# EAGLE design power supply (EAGLE 6.0)
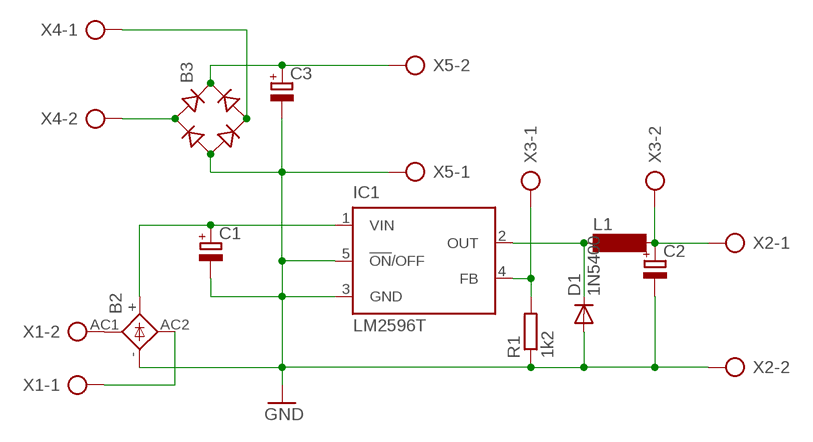
[diagram p0: schematic, sheet 1]

## Parts
B2  FB15  [FB15]
B3  B-DIL  [B-DIL]
C1  CPOL-EUTT5D11  [TT5D11]
C2  CPOL-EUTT5D11  [TT5D11]
C3  CPOL-EUTT5D11  [TT5D11]
D1  1N5400  [DO201-15]
IC1  LM2596T  [T05D]
L1  SD12K-82  [SD12K-82]
R1  1k2  R-EU_0207/10  [0207/10]
X1  AK300/2  [AK300/2]
X2  AK300/2  [AK300/2]
X3  AK300/2  [AK300/2]
X4  AK300/2  [AK300/2]
X5  AK300/2  [AK300/2]

## Nets
+12V: B2.+ C1.+ IC1.1(VIN)
GND: B2.- B3.- C1.- C2.- C3.- D1.A IC1.3(GND) IC1.5(!ON!/OFF) R1.1 X2.2 X5.1
N$1: IC1.4(FB) R1.2 X3.1
N$2: B2.AC2 X1.1
N$3: C2.+ L1.2 X2.1 X3.2
N$4: B2.AC1 X1.2
N$5: B3.AC1 X4.2
N$6: D1.C IC1.2(OUT) L1.1
N$7: B3.AC2 X4.1
N$9: B3.+ C3.+ X5.2

## Library data of the parts
B2 = rectifier:FB15: FAGOR RECTIFIER grid 3 x 5 mm
B3 = rectifier:B-DIL: RECTIFIER
C1-C3 = rcl:CPOL-EU: POLARIZED CAPACITOR, European symbol
D1 = diode:1N5400: DIODE standard rectifier, 3 A, 50 V (Motorola)
IC1 = national-semiconductor:LM2596: SIMPLE SWITCHER® Power Converter 150 kHz 3A Step-Down Voltage Regulator Source: http://www.national.com/ds/LM/LM2596.pdf; MPN: LM2596T-ADJ/LF02; OC_FARNELL: 9494162; OC_NEWARK: 65K5910
L1 = inductor-neosid:SD12: INDUCTOR nominal inductance; OC_FARNELL: unknown; OC_NEWARK: unknown
R1 = rcl:R-EU_: RESISTOR, European symbol
X1-X5 = con-ptr500:AK300/2: CONNECTOR; OC_FARNELL: unknown; OC_NEWARK: unknown

## Board
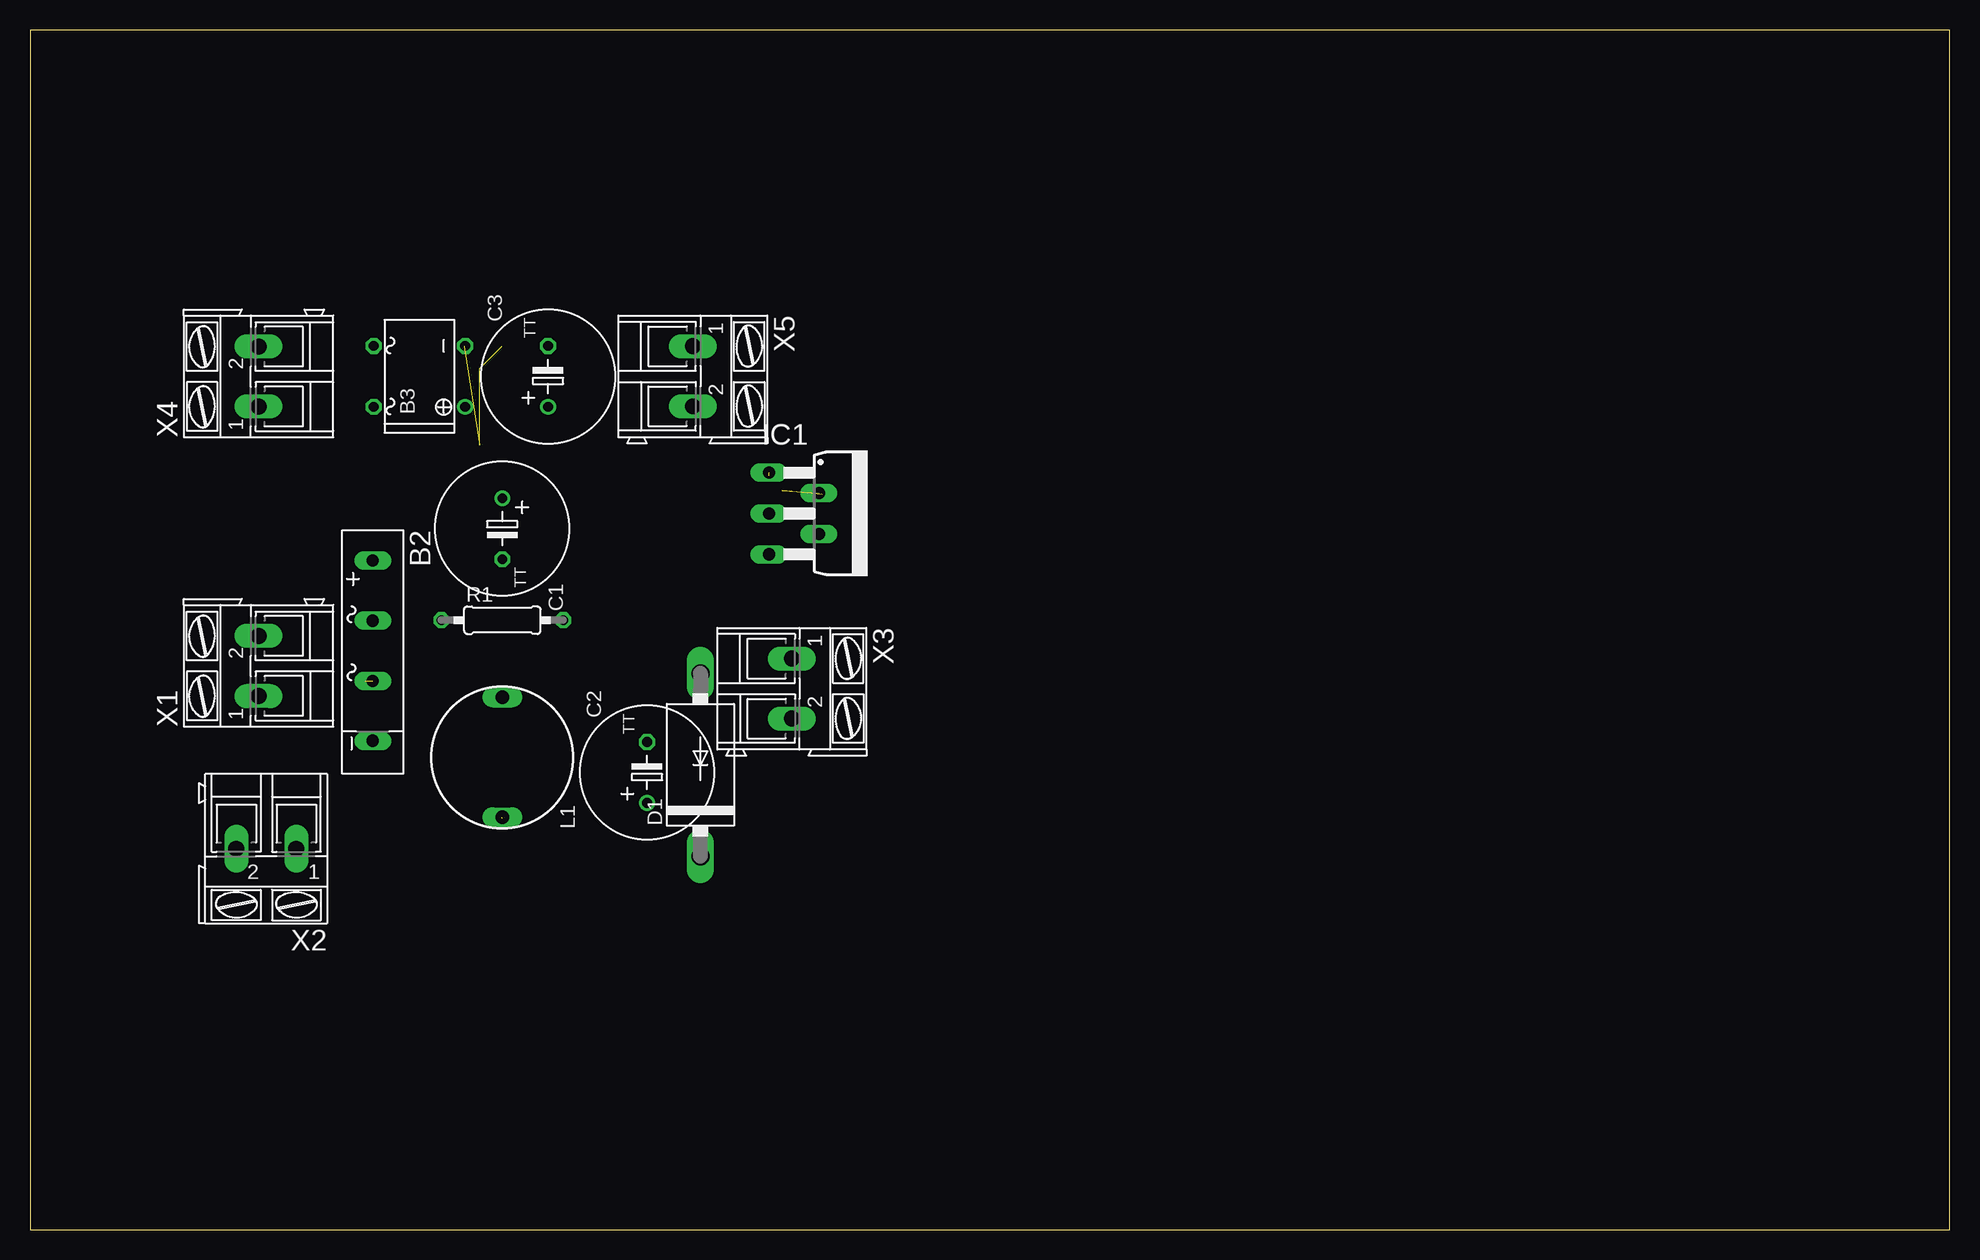
[diagram p1: board, top side]
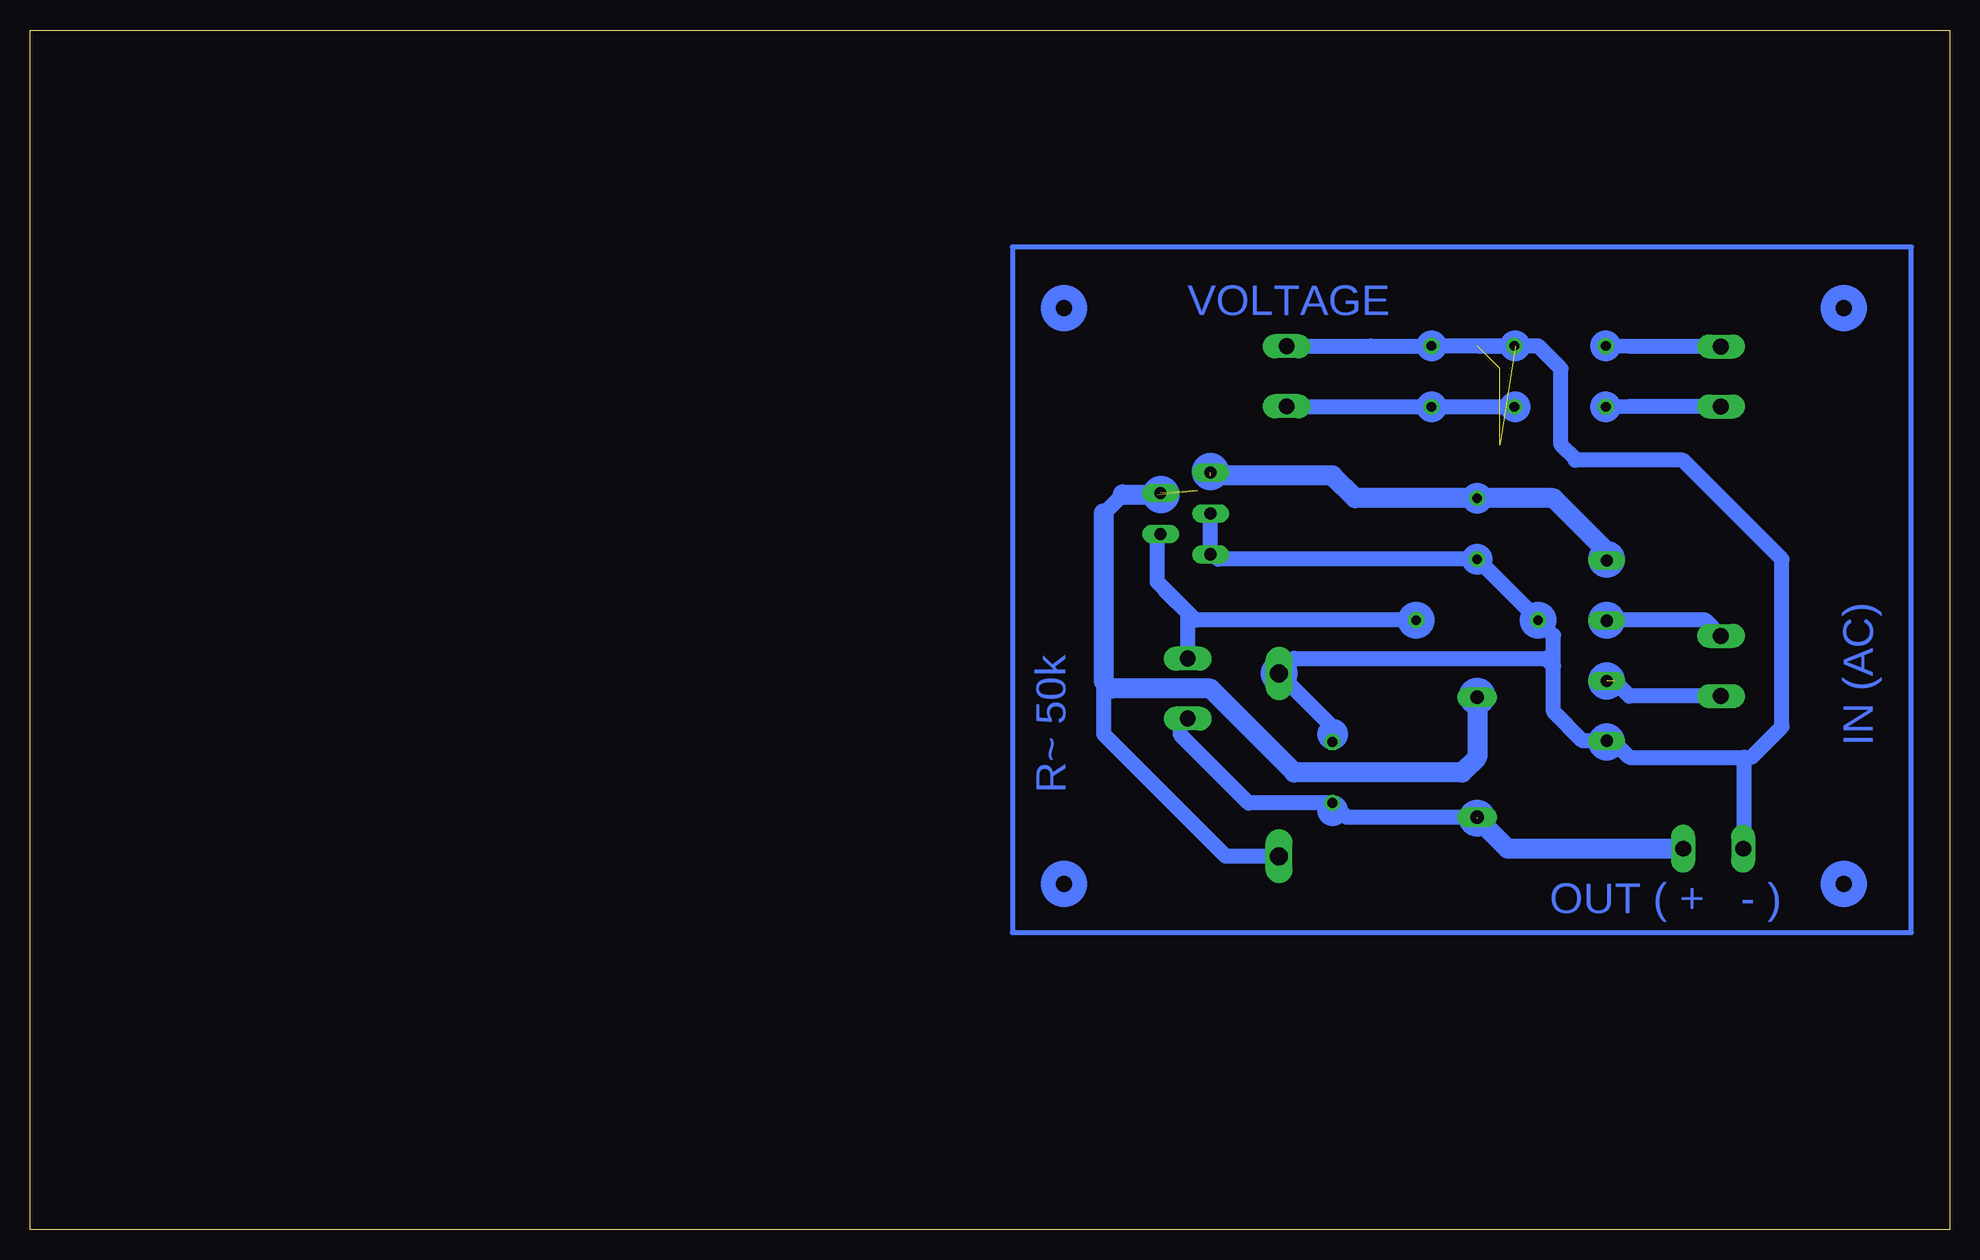
[diagram p2: board, bottom side, seen from below]

Size 160 x 100 mm. Coordinates in mm from the lower left corner, seen from the top.
Outline: 0,0 160,0 160,100 0,100 0,0
Copper layers (1*16): Top 0.035mm / dielectric 1.5mm / Bottom 0.035mm
Design rules: minimum track width 10mil, minimum drill 24mil, track to track 8mil, track to pad 8mil, pad to pad 8mil, via to via 8mil, smd to smd 8mil, copper to edge 40mil, drill to drill 8mil, minimum pad ring 10mil, minimum via ring 8mil, stop-mask expansion 4mil, vias tented up to drill 0mil, thermal gap 10mil

### Footprints (pad centres in the part's own frame; a part is rotated, then mirrored left to right if it is on the bottom)
FB15 = drill 1.016 long: + -7.5,0; - 7.511,0; AC1 -2.496,0; AC2 2.533,0
B-DIL = drill 0.813: + -2.54,-3.81 | drill 0.813 octagon: - 2.54,-3.81; AC1 2.54,3.81; AC2 -2.54,3.81
TT5D11 = drill 0.813: + -2.54,0 | drill 0.813 octagon: - 2.54,0
DO201-15 = drill 1.499 long: A 7.62,0; C -7.62,0
T05D = drill 1.016 long: 1 -3.404,-5.08; 2 -1.702,-0.914; 3 0,-5.08; 4 1.702,-0.914; 5 3.404,-5.08
SD12K-82 = drill 1.1 long: 1 -5,0; 2 5,0
0207/10 = drill 0.813 octagon: 1 -5.08,0; 2 5.08,0
AK300/2 = drill 1.321 long: 1 -2.515,0; 2 2.489,0

### Placement (x,y rotation side)
B2  28.57,48.26 270 top
B3  32.47,71.12 90 top
C1  39.37,58.42 270 top
C2  51.44,38.1 90 top
C3  43.18,71.12 90 top
D1  55.88,38.73 90 top
IC1  66.67,59.69 270 top
L1  39.37,39.37 270 top
R1  39.37,50.8 0 top
X1  19.05,46.99 90 top
X2  19.68,31.75 180 top
X3  63.5,45.09 270 top
X4  19.05,71.12 90 top
X5  55.24,71.12 270 top

### Tracks (layer width: path | path; a pad name or v marks a point on that pad's centre or on a via)
+12V  (1 unrouted)
  Bottom 1.27: B2.+ 28.57,56.52
  Bottom 1.676: 28.57,56.52 33.02,60.96 C1.+ 49.53,60.96 51.44,62.87 61.59,62.87
GND  (3 unrouted)
  Bottom 0.406: C1.- 39.6,55.65 60.96,55.65 IC1.5 61.59,56.52
  Bottom 1.27: IC1.3 61.59,56.52 60.96,55.88 C1.- R1.1 33.02,49.53 33.02,46.99 | 33.02,46.99 33.02,43.18 30.59,40.75 B2.- 28.05,40.75 26.67,39.37 17.14,39.37 | C2.- 51.44,41.91 D1.A 54.61,47.62 33.66,47.62 33.02,46.99 | X5.1 50.77,73.64 48.26,73.66 C3.- B3.- 39.37,73.66 | 17.14,39.37 17.14,31.8 X2.2 | 17.14,39.37 16.51,39.37 13.97,41.91 13.97,55.88 22.23,64.14 31.2,64.14 31.2,64.22 32.38,65.41 32.38,71.75 34.29,73.66 36.2,73.66
N$1
  Bottom 0.406: R1.2 63.5,50.8 | IC1.4 65.76,53.06 63.5,50.8 | X3.1 63.5,47.62 63.5,50.8
  Bottom 1.27: R1.2 62.87,50.8 63.5,51.44 | 63.5,51.44 66.04,53.98 66.04,57.78 | 63.5,47.62 63.5,51.44
N$2  (1 unrouted)
  Bottom 1.27: X1.1 26.7,44.48 27.94,45.72
N$3  (1 unrouted)
  Bottom 0.406: 64.14,41.27 64.14,41.96 X3.2
  Bottom 1.27: 63.5,42.55 64.14,42.55 64.14,41.27 58.42,35.56 C2.+ 50.24,34.37 L1.2
  Bottom 1.676: X2.1 36.83,31.75 39.37,34.29
N$4
  Bottom 1.27: X1.2 19.05,49.53 20.32,50.8 28.53,50.8 B2.AC1
N$5
  Bottom 1.27: X4.2 26.62,73.61 B3.AC1
N$6  (2 unrouted)
  Bottom 1.27: 69.85,45.09 70.48,45.72 70.48,41.27 60.33,31.11 D1.C | 70.48,59.69 68.9,61.28
  Bottom 1.676: L1.1 39.37,39.37 40.64,38.1 54.61,38.1 61.59,45.09 69.85,45.09 | 70.48,45.72 70.48,59.69 | 68.9,61.28 66.04,61.28
N$7
  Bottom 1.27: X4.1 26.64,68.61 B3.AC2
N$8
  Bottom 0.406: 3.17,81.92 78.11,81.92 78.11,24.77 3.17,24.77 3.17,81.92
N$9
  Bottom 1.27: B3.+ C3.+ 55.19,68.58 X5.2
(copper drawn outside any net)
  shapes: Bottom circle x25

### Text on the board
Bottom: VOLTAGE | R~ 50k | IN (AC) | OUT ( + - )